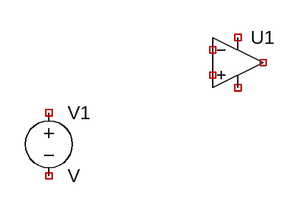
[diagram p0: schematic Draft3.asc]
Draft3.asc, the LTspice schematic file:
Version 4
SHEET 1 880 680
SYMBOL Opamps\\UniversalOpamp2 112 144 R0
SYMATTR InstName U1
SYMBOL voltage -128 192 R0
SYMATTR InstName V1

The netlist it stands for:
* Draft3.asc
XU1 NC_01 NC_02 NC_03 NC_04 NC_05 level.2 Avol=1Meg GBW=10Meg Slew=10Meg ilimit=25m rail=0 Vos=0 phimargin=45 en=0 enk=0 in=0 ink=0 Rin=500Meg  ; pins IN+ IN- V+ V- OUT
V1 NC_06 NC_07 V
.lib UniversalOpamps2.sub
.backanno
.end